# Altium schematic sheet TB906_HW V1.SchDoc
size 513 x 386 mm
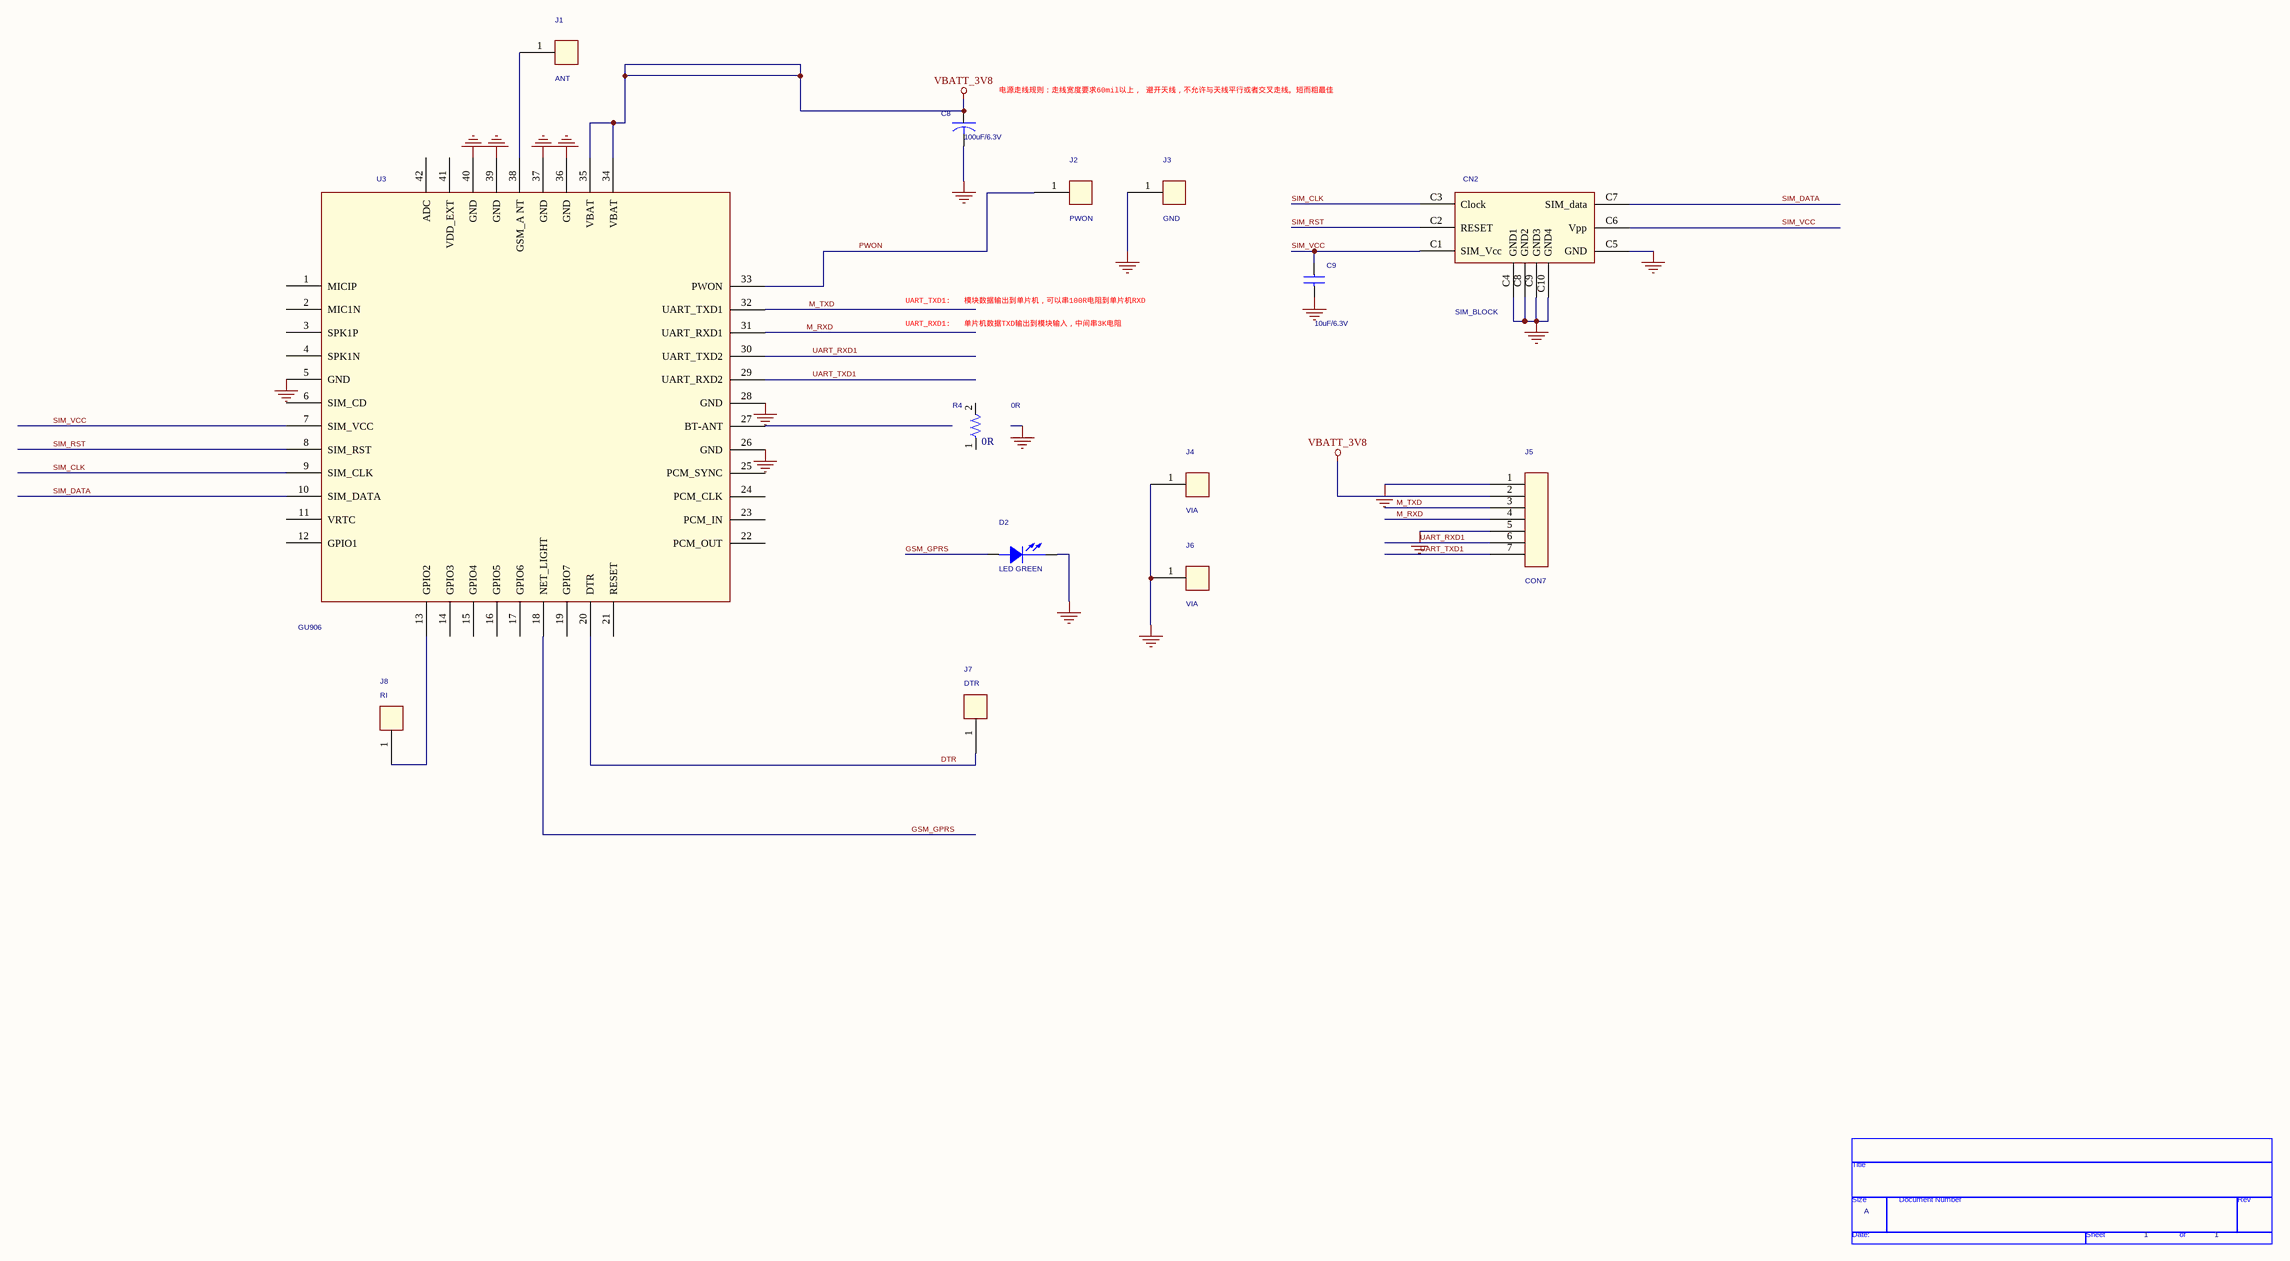
[diagram p0: TB906_HW V1.SchDoc]

## Parts
*  Page Count: 1  Page Size: A  (hidden comment: TitleBlock0)  (graphical)
C8  100uF/6.3V  [1210]
C9  10uF/6.3V  [0603]
CN2  SIM_BLOCK  [SIM_BLOCK]
D2  LED GREEN  [D3.9_LED]
J1  ANT  [TB906_ANT]
J2  PWON  [TP60MIL]
J3  GND  [TP60MIL]
J4  VIA  [VIA_2.5MM]
J5  CON7  [SDIP_2.54_7P]
J6  VIA  [VIA_2.5MM]
J7  DTR  [TP60MIL]
J8  RI  [TP60MIL]
R4  0R  [AX/RC05]
U3  GU906  [HFY_QFN_42_DTU]

## Nets
GND: C8.2 C9.2 CN2.C4(GND1) CN2.C5(GND) CN2.C8(GND2) CN2.C9(GND3) CN2.C10(GND4) D2.2(CATHODE) J3.1 J4.1 J5.1 J5.5 J6.1 U3.5(GND) U3.26(GND) U3.28(GND) U3.36(GND) U3.37(GND) U3.39(GND) U3.40(GND)
VBATT_3V8: C8.1 J5.2 U3.34(VBAT) U3.35(VBAT)
DTR: J7.1 U3.20(DTR)
GSM_GPRS: D2.1(ANODE) U3.18(NET_LIGHT)
M_RXD: J5.4 U3.31(UART_RXD1)
M_TXD: J5.3 U3.32(UART_TXD1)
PWON: J2.1 U3.33(PWON)
SIM_CLK: CN2.C3(Clock) U3.9(SIM_CLK)
SIM_DATA: CN2.C7(SIM_data) U3.10(SIM_DATA)
SIM_RST: CN2.C2(RESET) U3.8(SIM_RST)
SIM_VCC: C9.1 CN2.C1(SIM_Vcc) CN2.C6(Vpp) U3.7(SIM_VCC)
UART_RXD1: J5.6 U3.30(UART_TXD2)
UART_TXD1: J5.7 U3.29(UART_RXD2)
NetJ1_1: J1.1 U3.38(GSM_A_NT)
NetJ8_1: J8.1 U3.13(GPIO2)

Not connected (* = marked no-connect by the designer): R4 1 2; U3 1(MICIP) 2(MIC1N) 3(SPK1P) 4(SPK1N) 6(SIM_CD) 11(VRTC) 12(GPIO1) 14(GPIO3) 15(GPIO4) 16(GPIO5) 17(GPIO6) 19(GPIO7) 21(RESET) 22(PCM_OUT) 23(PCM_IN) 24(PCM_CLK) 25(PCM_SYNC) 27(BT-ANT) 41(VDD_EXT) 42(ADC)

## Notes on the sheet
- (near C8) 电源走线规则：走线宽度要求60mil以上， 避开天线，不允许与天线平行或者交叉走线。短而粗最佳
- UART_TXD1:   模块数据输出到单片机，可以串100R电阻到单片机RXD
- UART_RXD1:   单片机数据TXD输出到模块输入，中间串3K电阻
- (in symbol TitleBlock0) Title; Size; Document Number; Rev; Date:; Sheet; of

## Library data of the parts
C8 = CAP_5: Pic Spec: C1206
C9 = CAP NP
CN2 = SIM_BLOCK_2
D2 = LED
J1-J4 J6-J8 = CON1
R4 = r: PSpiceTemplate: R^@REFDES %1 %2 ?TOLERANCE|R^@REFDES| @VALUE  ?TOLERANCE|\n.model r^@REFDES RES R=1 DEV=@TOLERANCE%|; Value: 0R
U3 = GU600_LIB_2
* = TitleBlock0: Page Number: 1; Page Create Date: March  8, 1995